# EAGLE design Lasershield (EAGLE 5.09)
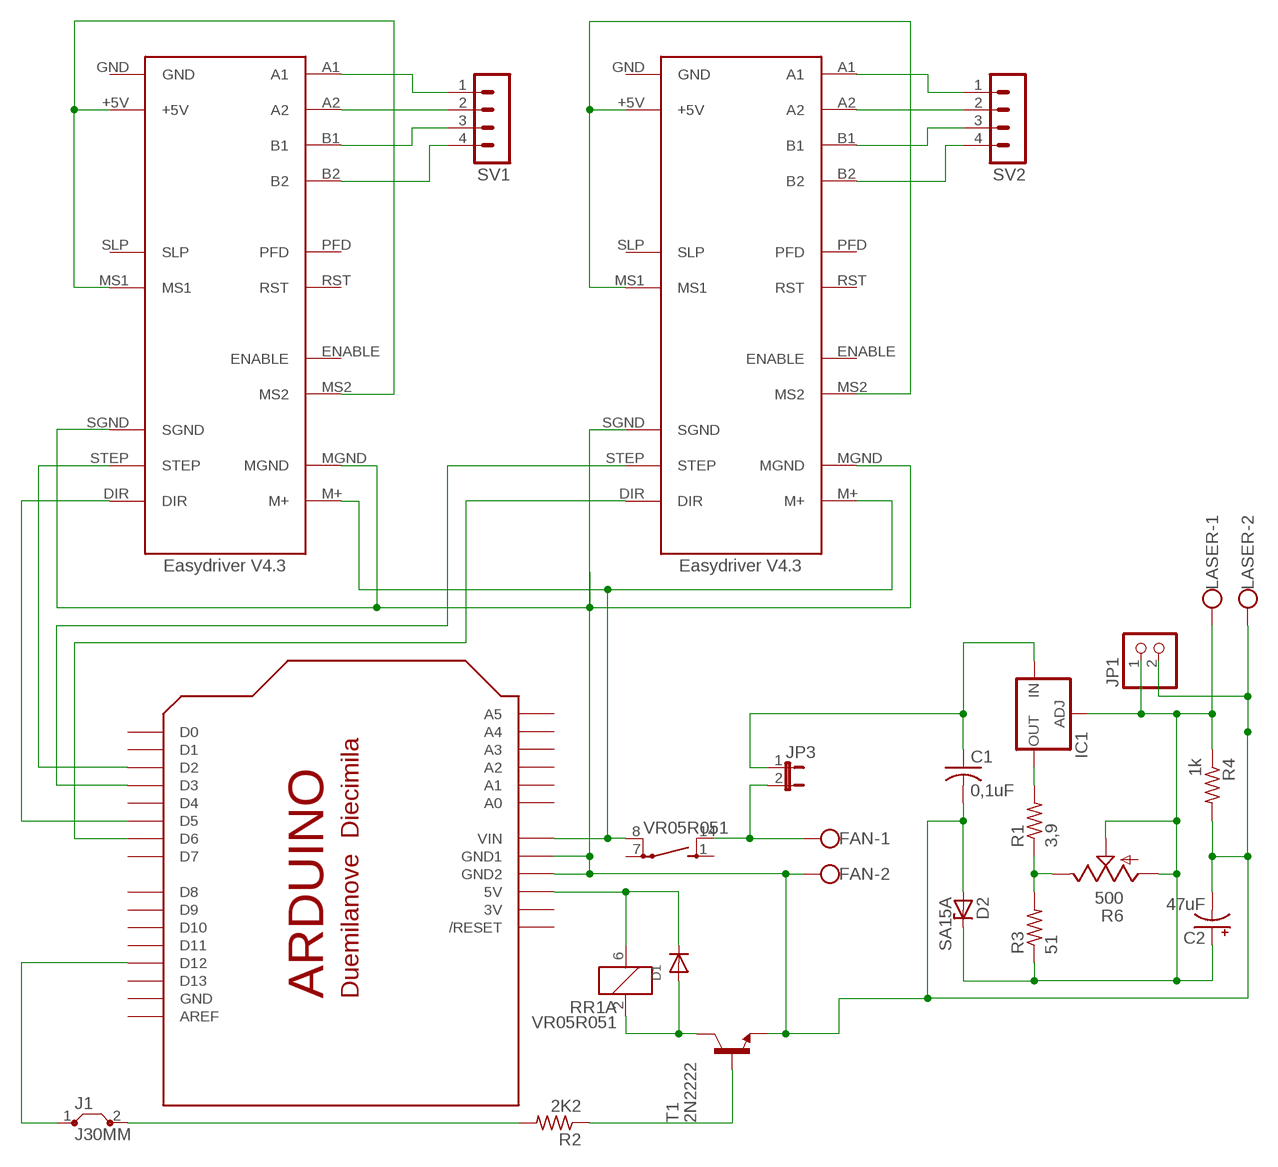
[diagram p0: schematic, sheet 1]

## Parts
C1  0,1uF  C-US075-052X106  [C075-052X106]
C2  47uF  CPOL-USE2.5-5  [E2,5-5]
D1  DIODEDO-1N4148  [DO-1N4148]
D2  SA15A  ZENER-DIODEP1-Z12  [P1Z12]
FAN  W237-102  [W237-102]
IC1  LM317TS  [317TS]
J1  J30MM  [30]
JP1  PINHD-1X2  [1X02]
JP3  JP1E  [JP1]
LASER  W237-102  [W237-102]
R1  3,9  R-US_0414/5V  [0414V]
R2  2K2  R-US_0207/10  [0207/10]
R3  51  R-US_0414/5V  [0414V]
R4  1k  R-US_0414/5V  [0414V]
R6  500  TRIM_US-S64W  [S64W]
SV1  MA04-1  [MA04-1]
SV2  MA04-1  [MA04-1]
T1  2N2222  [TO18]
U$1  EASYDRIVER  [EASYDRIVER]
U$2  EASYDRIVER  [EASYDRIVER]
U$4  ARDUINO-NOHOLE  [ARDUINO-NOHOLE]
VR05R051  RR1A  [RR1A]

## Nets
N$1: IC1.2(OUT) R1.2
N$2: SV1.1 U$1.A1
N$4: D1.C U$4.5V VR05R051.6
N$5: U$1.+5V U$1.MS1 U$1.MS2
N$6: U$2.+5V U$2.MS1 U$2.MS2
N$7: U$1.STEP U$4.D2
N$8: U$2.STEP U$4.D3
N$9: U$1.DIR U$4.D5
N$10: U$2.DIR U$4.D6
N$11: J1.1 U$4.D12
N$13: SV1.2 U$1.A2
N$14: D1.A T1.3(C) VR05R051.2
N$15: C1.1 IC1.3(IN) JP3.1
N$16: R2.1 T1.2(B)
N$17: SV1.3 U$1.B1
N$18: SV1.4 U$1.B2
N$19: SV2.1 U$2.A1
N$20: SV2.2 U$2.A2
N$21: SV2.3 U$2.B1
N$22: SV2.4 U$2.B2
N$23: FAN.1 JP3.2 VR05R051.14(2:S)
N$27: J1.2 R2.2
N$28: C1.2 C2.- D2.A FAN.2 JP1.2 LASER.2 R4.2 T1.1(E) U$1.MGND U$1.SGND U$2.MGND U$2.SGND U$4.GND1 U$4.GND2
N$31: U$1.M+ U$2.M+ U$4.VIN VR05R051.8(2:P)
N$32: R1.1 R3.2 R6.E
N$35: C2.+ D2.C IC1.1(ADJ) JP1.1 LASER.1 R3.1 R4.1 R6.A R6.S
Unconnected: U$1.ENABLE U$1.PFD U$1.RST U$1.SLP U$2.ENABLE U$2.PFD U$2.RST U$2.SLP U$4.A0 U$4.A1 U$4.A2 U$4.A3 U$4.A4 U$4.A5 U$4.AREF U$4.D0 U$4.D1 U$4.D4 U$4.D7 U$4.D8 U$4.D9 U$4.D10 U$4.D11 U$4.D13 U$4.RESET(/RESET) VR05R051.1(2:S) VR05R051.7(2:P)

## Power pins joined to a net without a drawn wire
3V: U$4.3V
GND: U$1.GND U$2.GND U$4.GND

## Library data of the parts
C1 = rcl:C-US: CAPACITOR, American symbol
C2 = rcl:CPOL-US: POLARIZED CAPACITOR, American symbol
D1 = adafruit:DIODE: Diode SMADIODE - SMA Surface Mount Package 20V 1A Schottky Diode Digikey: 641-1014-6-ND DO-1N4148 - Through Hole Small Current Diode SOD-123 20V 1 A (.5mV Vf) Schottky Diode - Digikey: MBRX120TPMSCT-ND SOD-323 10V 570mA (.38mV Vf, 3ns) Schottky Diode - Digikey: ZLLS410CT-ND SOD-523 30V 30mA Schottky Diode (RB751S-40TE61) - Digikey: RB751S-40TE61CT-ND SOT23-R/W - SOT23 Package (R = Solder Paste/Reflow Ovens, W = Hand-Soldering) BAT54Film 40V 300mA - Digikey: 497-7162-1-ND
D2 = diode:ZENER-DIODE: Z-Diode
FAN LASER = con-wago-500:W237-102: WAGO SCREW CLAMP
IC1 = v-reg:LM317TS: VOLTAGE REGULATOR
J1 = jumper:J: Bridge
JP1 = pinhead:PINHD-1X2: PIN HEADER
JP3 = jumper:JP1E: JUMPER
R1-R4 = rcl:R-US_: RESISTOR, American symbol
R6 = pot:TRIM_US-: POTENTIOMETER
SV1 SV2 = con-lstb:MA04-1: PIN HEADER
T1 = transistor:2N2222: NPN TRANSISTOR
U$1 U$2 = easydriver:EASYDRIVER: Easydriver V4.3
U$4 = adafruit:ARDUINO: Arduino Diecimila/Duemilanove Make a shield with ease, this package has all the named pins as well as the two mounting drill holes and an outline of the USB and DC power connector. The outline is on the DIMENSION layer, so if your board house uses it they will cut the outline to match. http://www.ladyada.net/library/pcb/eaglelibrary.html
VR05R051 = relay:RR1A: RELAY reed, polarity, 1 x norm. open with shield

## Board
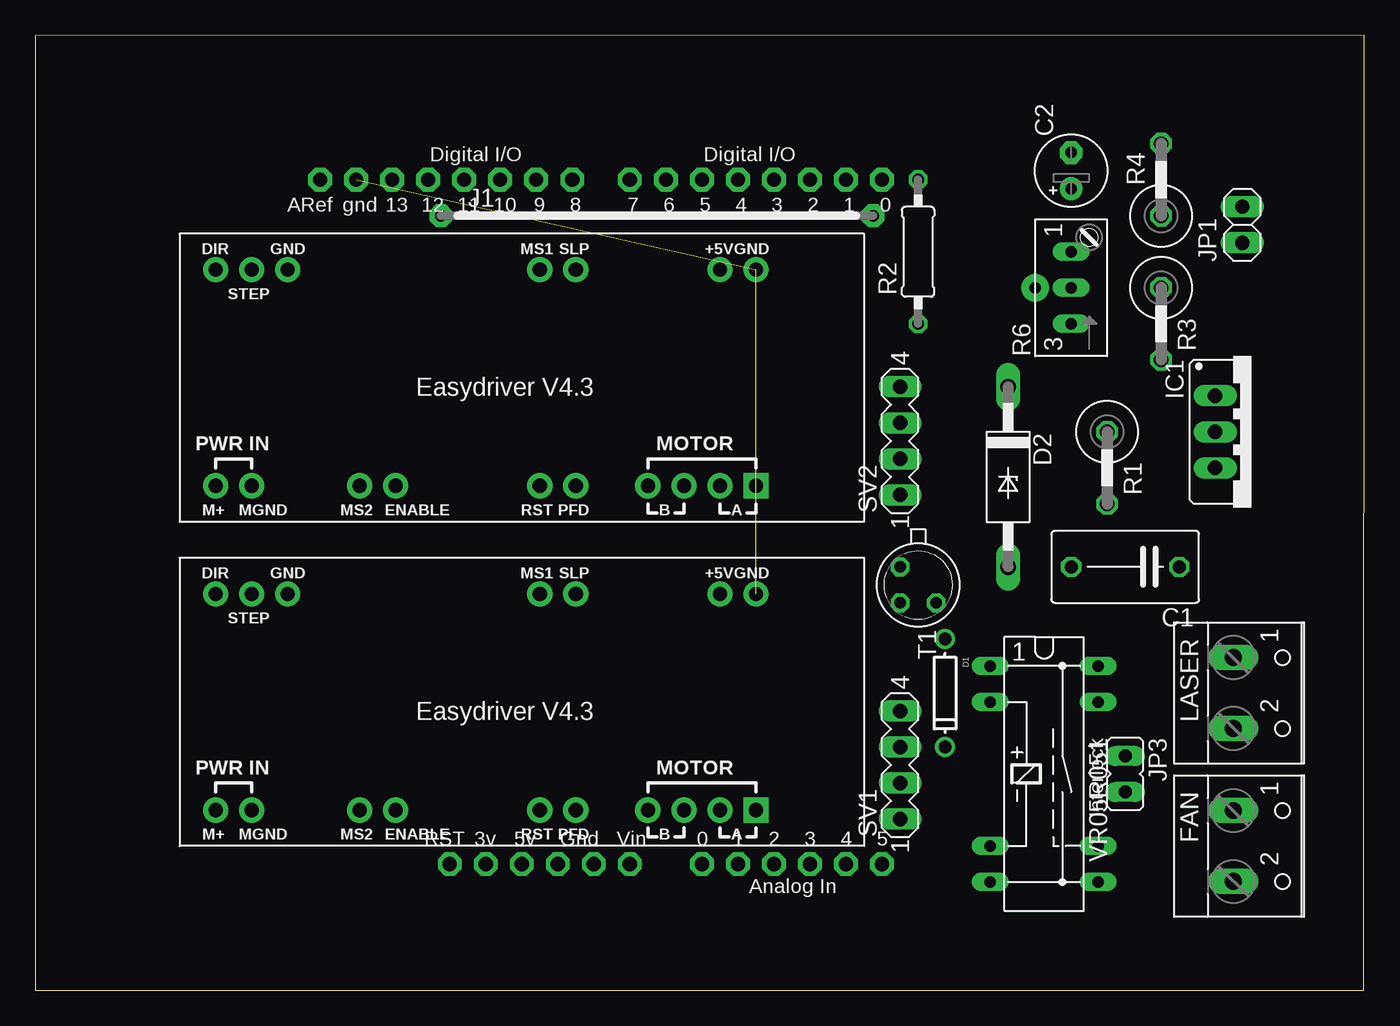
[diagram p1: board, top side]
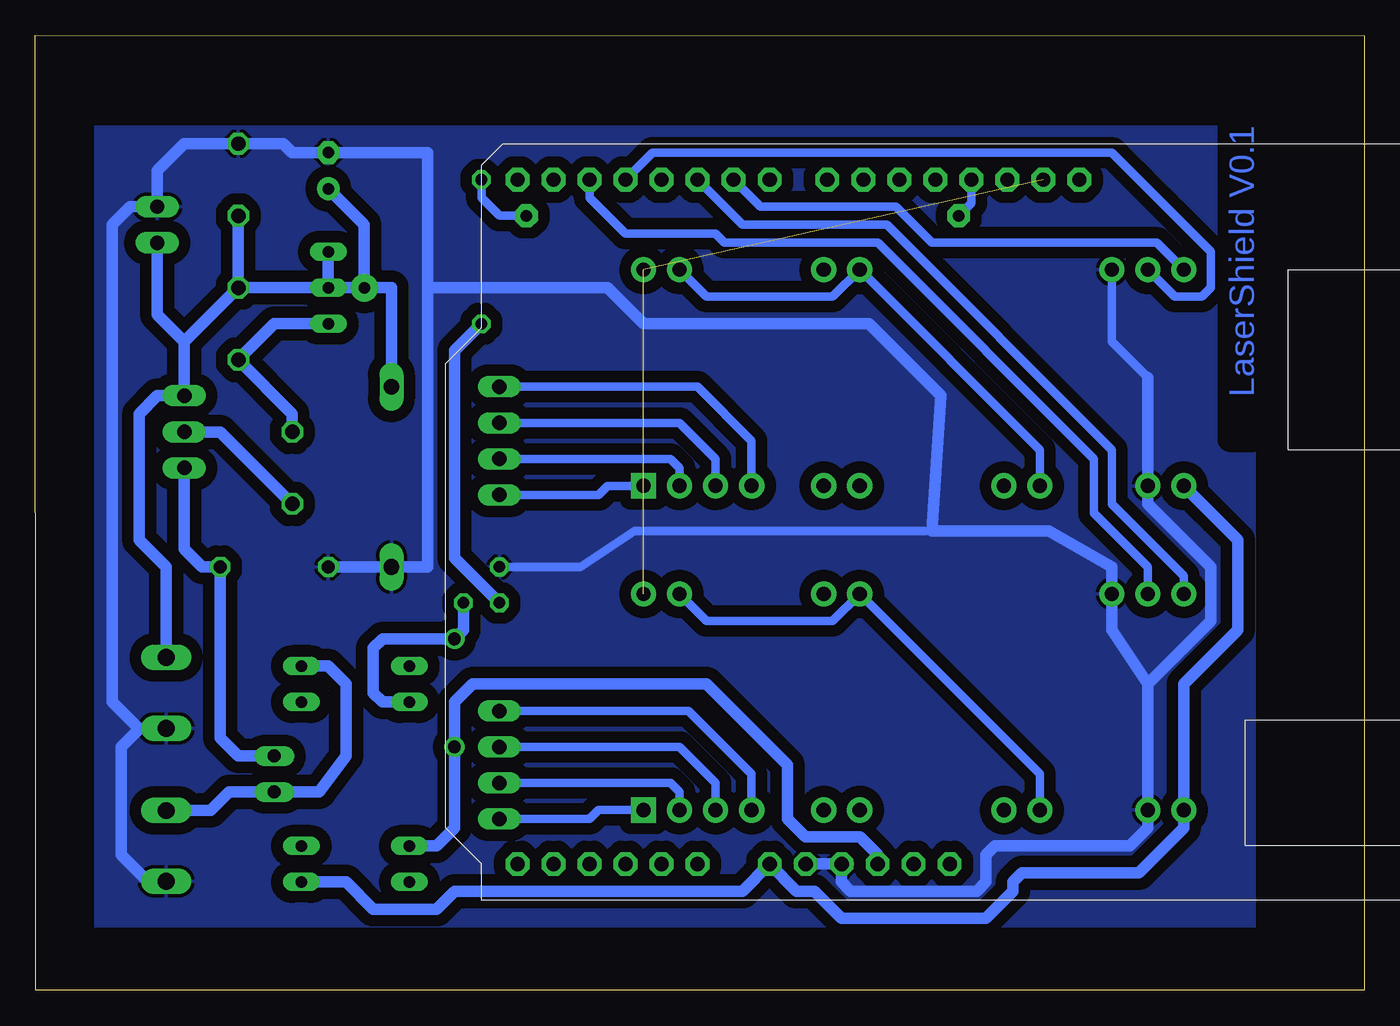
[diagram p2: board, bottom side, seen from below]

Size 93.67 x 67.32 mm. Coordinates in mm from the lower left corner, seen from the top.
Outline: 0,0 93.65,0 93.67,67.32 0,67.3 0,0
Copper layers (1*16): Top 0.035mm / dielectric 1.5mm / Bottom 0.035mm
Design rules "default": minimum track width 10mil, minimum drill 24mil, track to track 8mil, track to pad 8mil, pad to pad 8mil, via to via 8mil, smd to smd 8mil, copper to edge 40mil, drill to drill 8mil, minimum pad ring 10mil, minimum via ring 8mil, stop-mask expansion 4mil, vias tented up to drill 0mil, thermal gap 10mil

### Footprints (pad centres in the part's own frame; a part is rotated, then mirrored left to right if it is on the bottom)
C075-052X106 = drill 0.914 octagon: 1 -3.81,0; 2 3.81,0
E2,5-5 = drill 0.813 pad 1.6 round: + -1.27,0 | drill 0.813 pad 1.6 octagon: - 1.27,0
DO-1N4148 = drill 0.9 round: A -3.81,0; C 3.81,0
P1Z12 = drill 1.118 long: A 6.35,0; C -6.35,0
W237-102 = drill 1.194 long: 1 -2.5,-1.27; 2 2.5,-1.27
317TS = drill 1.016 long: 1 -2.54,-2.54; 2 0,-2.54; 3 2.54,-2.54
30 = drill 0.813 pad 1.6 octagon: 1 -15.24,0; 2 15.24,0
1X02 = drill 1.016 long: 1 -1.27,0; 2 1.27,0
JP1 = drill 0.914 long: 1 0,-1.27; 2 0,1.27
0414V = drill 1.016 octagon: 1 -2.54,0; 2 2.54,0
0207/10 = drill 0.813 octagon: 1 -5.08,0; 2 5.08,0
S64W = drill 0.813 long: A 2.54,1.27; E -2.54,1.27; S 0,1.27
MA04-1 = drill 1.016 long: 1 -3.81,0; 2 -1.27,0; 3 1.27,0; 4 3.81,0
TO18 = drill 0.813 octagon: 1 -1.27,-1.27; 2 1.27,-1.27; 3 1.27,1.27
EASYDRIVER = drill 1 pad 1.778 round: +5V -13.97,-7.62; A2 -13.97,7.62; B1 -11.43,7.62; B2 -8.89,7.62; DIR 21.59,-7.62; ENABLE 8.89,7.62; GND -16.51,-7.62; M+ 21.59,7.62; MGND 19.05,7.62; MS1 -1.27,-7.62; MS2 11.43,7.62; PFD -3.81,7.62; RST -1.27,7.62; SGND 16.51,-7.62; SLP -3.81,-7.62; STEP 19.05,-7.62 | drill 1 pad 1.778 square: A1 -16.51,7.62
ARDUINO-NOHOLE = drill 1 pad 1.676 octagon: 3V 35.56,2.54; 5V 38.1,2.54; A0 50.8,2.54; A1 53.34,2.54; A2 55.88,2.54; A3 58.42,2.54; A4 60.96,2.54; A5 63.5,2.54; AREF 23.876,50.8; D0 63.5,50.8; D1 60.96,50.8; D2 58.42,50.8; D3 55.88,50.8; D4 53.34,50.8; D5 50.8,50.8; D6 48.26,50.8; D7 45.72,50.8; D8 41.656,50.8; D9 39.116,50.8; D10 36.576,50.8; D11 34.036,50.8; D12 31.496,50.8; D13 28.956,50.8; GND 26.416,50.8; GND1 43.18,2.54; GND2 40.64,2.54; RESET 33.02,2.54; VIN 45.72,2.54
RR1A = drill 0.813 long: 1 -7.62,-3.81; 2 -5.08,-3.81; 6 5.08,-3.81; 7 7.62,-3.81; 8 7.62,3.81; 9 5.08,3.81; 13 -5.08,3.81; 14 -7.62,3.81

### Placement (x,y rotation side)
C1  76.83,29.84 180 top
C2  73.02,57.79 90 top
D1  64.13,20.95 270 top
D2  68.58,36.2 270 top
FAN  85.72,10.16 270 top
IC1  85.72,39.37 270 top
J1  43.81,54.61 0 top
JP1  85.09,53.98 90 top
JP3  76.83,15.24 180 top
LASER  85.72,20.95 270 top
R1  75.56,36.83 270 top
R2  62.23,52.07 90 top
R3  79.38,46.99 270 top
R4  79.38,57.15 90 top
R6  74.3,49.53 90 top
SV1  60.96,15.88 90 top
SV2  60.96,38.73 90 top
T1  62.23,28.57 270 top
U$1  34.29,20.32 180 top
U$2  34.29,43.18 180 top
U$4  -3.81,6.35 0 top
VR05R051  71.12,15.24 270 top

### Tracks (layer width: path | path; a pad name or v marks a point on that pad's centre or on a via)
GND  (2 unrouted)
N$1
  Bottom 0.813: IC1.2 80.64,39.37 R1.2
N$2
  Bottom 0.61: U$1.A1 53.97,12.7 54.61,12.06 SV1.1
N$4
  Bottom 0.813: U$4.5V 34.29,9.53 35.56,10.79 39.37,10.79 40.64,12.06 40.64,15.88 46.35,21.59 62.86,21.59 64.13,20.32 D1.C 64.13,11.43 65.41,10.16 VR05R051.6
N$5
  Bottom 0.61: U$1.+5V 46.35,26.04 37.46,26.04 U$1.MS1 22.86,15.24 U$1.MS2
N$6
  Bottom 0.61: U$2.+5V 46.35,48.9 37.46,48.9 U$2.MS1 22.86,38.1 U$2.MS2
N$7
  Bottom 0.61: U$4.D2 54.61,55.88 52.07,53.34 45.72,53.34 45.09,52.71 34.29,52.71 19.05,37.47 19.05,33.66 15.24,29.84 U$1.STEP
N$8
  Bottom 0.61: U$4.D3 50.16,59.05 17.78,59.05 10.79,52.07 10.79,49.53 11.43,48.9 13.33,48.9 U$2.STEP
N$9
  Bottom 0.61: U$4.D5 43.81,53.98 33.66,53.98 17.78,38.1 17.78,34.29 12.7,29.21 U$1.DIR
N$10
  Bottom 0.61: U$4.D6 42.54,55.25 33.02,55.25 30.48,52.71 14.6,52.71 U$2.DIR
N$11
  Bottom 0.61: U$4.D12 27.69,55.5 J1.1
N$13
  Bottom 0.61: SV1.2 48.89,14.61 48.26,13.97 U$1.A2
N$14
  Bottom 0.813: T1.3 63.5,25.4 D1.A 69.22,24.76 69.85,24.13 69.85,20.95 69.22,20.32 VR05R051.2
N$15
  Bottom 0.813: JP3.1 79.38,16.51 80.64,17.78 C1.1 81.91,29.84 83.19,31.11 IC1.3
N$16
  Bottom 0.813: T1.2 64.13,30.48 64.13,45.09 R2.1
N$17
  Bottom 0.61: SV1.3 48.26,17.14 45.72,14.61 U$1.B1
N$18
  Bottom 0.61: SV1.4 47.62,19.68 43.18,15.24 U$1.B2
N$19
  Bottom 0.61: SV2.1 53.97,34.93 53.34,35.56 U$2.A1
N$20
  Bottom 0.61: SV2.2 48.89,37.47 48.26,36.83 U$2.A2
N$21
  Bottom 0.61: SV2.3 48.26,40.01 45.72,37.47 U$2.B1
N$22
  Bottom 0.61: SV2.4 46.99,42.55 43.18,38.73 U$2.B2
N$23
  Bottom 0.813: FAN.1 81.32,12.66 80.01,13.97 JP3.2 73.66,13.97 71.75,16.51 71.75,21.59 73.02,22.86 VR05R051.14
N$27
  Bottom 0.61: J1.2 60.96,54.61 62.23,55.88 R2.2
N$28
  Bottom 0.61: T1.1 55.24,29.84 51.43,32.39 30.48,32.39 | 72.39,59.05 C2.- | U$2.SGND 17.78,45.72 15.24,43.18
  Bottom 0.813: 15.24,43.18 U$2.MGND 15.24,34.29 10.79,29.84 10.79,26.04 15.24,21.59 | 15.24,21.59 17.78,25.4 U$1.SGND 17.78,29.84 22.23,32.39 30.48,32.39 29.85,41.91 34.92,46.99 50.8,46.99 53.34,49.53 66.04,49.53 | 15.24,21.59 U$1.MGND 15.24,11.43 16.51,10.16 26.04,10.16 26.67,9.53 26.67,7.62 27.3,6.99 36.2,6.99 36.83,7.62 U$4.GND2 U$4.GND1 | 66.04,49.53 66.04,59.05 72.39,59.05 | 66.04,49.53 66.04,29.84 D2.A C1.2 | C2.- 75.56,59.05 76.2,59.69 R4.2 83.19,59.69 85.09,57.79 JP1.2 87,55.25 88.27,53.98 88.27,20.32 86.4,18.45 LASER.2 84.5,18.41 86.36,18.41 87.63,17.14 87.63,9.53 85.77,7.66 FAN.2
  pour Bottom (isolate 0.813): 89.53,60.96 89.53,4.45 7.62,4.45 7.62,60.96
N$31
  Bottom 0.813: U$2.M+ 8.89,31.75 8.89,25.4 12.7,21.59 U$1.M+ 12.7,11.43 15.87,8.26 24.13,8.26 24.77,7.62 24.77,6.99 26.67,5.08 36.83,5.08 38.73,6.99 40,6.99 U$4.VIN 43.81,6.99 64.13,6.99 65.41,5.71 69.85,5.71 71.75,7.62 VR05R051.8
N$32
  Bottom 0.813: R1.1 75.56,40.64 R3.2 76.83,46.99 R6.E
N$35  (via drill 0.8 pad 1.93)
  Bottom 0.813: v70.48,49.53 70.48,53.98 C2.+ | R6.S v70.48,49.53 | R6.S R6.A | R3.1 R6.S | 83.19,45.72 IC1.1 85.09,41.91 86.36,40.64 86.36,31.75 84.45,29.84 LASER.1 | 83.19,45.72 R3.1 | R3.1 R4.1 | JP1.1 85.09,47.62 83.19,45.72 | v70.48,49.53 68.58,49.53 D2.C

### Text on the board
Bottom: LaserShield V0.1
tPlace: Interlock